# Altium schematic sheet LMS7002M Data.SchDoc
size E
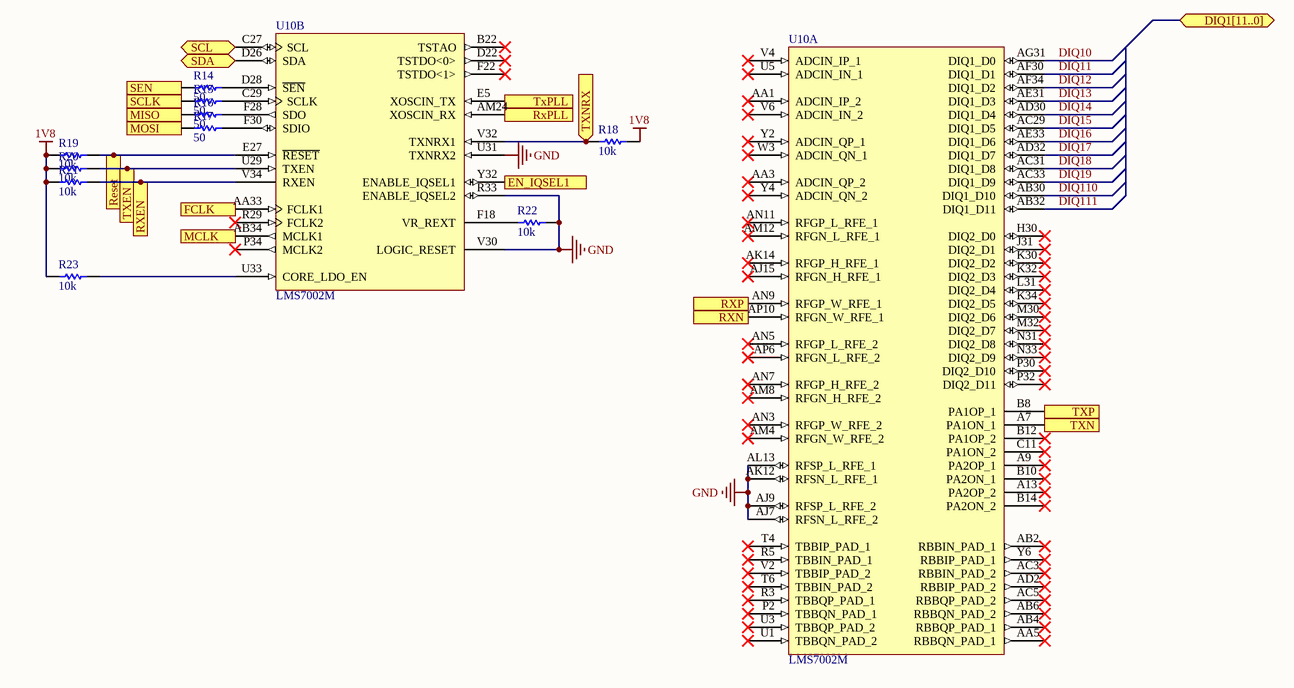
[diagram p0: LMS7002M Data.SchDoc]

## Parts
R14  value 50  [0402-A]  (hidden comment: Res1)
R15  value 50  [0402-A]  (hidden comment: Res1)
R16  value 50  [0402-A]  (hidden comment: Res1)
R17  value 50  [0402-A]  (hidden comment: Res1)
R18  value 10k  [0402-A]  (hidden comment: Res1)
R19  value 10k  [0402-A]  (hidden comment: Res1)
R20  value 10k  [0402-A]  (hidden comment: Res1)
R21  value 10k  [0402-A]  (hidden comment: Res1)
R22  value 10k  [0402-A]  (hidden comment: Res1)
R23  value 10k  [0402-A]  (hidden comment: Res1)
U10  LMS7002M  [LM-QFN-261_V]  (parts A,B of 4)

## Ports
DIQ1[11..0] (bidir), EN_IQSEL1 (in), FCLK (in), MCLK (out), MISO (out), MOSI (in), Reset (in), RXEN (in), RXN (in), RXP (in), RxPLL (in), SCL (bidir), SCLK (in), SDA (bidir), SEN (in), TXEN (in), TXN (out), TXNRX (in), TXP (out), TxPLL (in)

## Nets
1V8: R18.1 R19.2 R20.2 R21.2 R23.2
GND: R22.1 U10.AJ7(RFSN_L_RFE_2) U10.AJ9(RFSP_L_RFE_2) U10.AK12(RFSN_L_RFE_1) U10.AL13(RFSP_L_RFE_1) U10.R33(ENABLE_IQSEL2) U10.U31(TXNRX2) U10.V30(LOGIC_RESET)
DIQ10: U10.AG31(DIQ1_D0)
DIQ11: U10.AF30(DIQ1_D1)
DIQ12: U10.AF34(DIQ1_D2)
DIQ13: U10.AE31(DIQ1_D3)
DIQ14: U10.AD30(DIQ1_D4)
DIQ15: U10.AC29(DIQ1_D5)
DIQ16: U10.AE33(DIQ1_D6)
DIQ17: U10.AD32(DIQ1_D7)
DIQ18: U10.AC31(DIQ1_D8)
DIQ19: U10.AC33(DIQ1_D9)
DIQ110: U10.AB30(DIQ1_D10)
DIQ111: U10.AB32(DIQ1_D11)
EN_IQSEL1: U10.Y32(ENABLE_IQSEL1) ; port EN_IQSEL1
FCLK: U10.AA33(FCLK1) ; port FCLK
MCLK: U10.AB34(MCLK1) ; port MCLK
MISO: R16.2 ; port MISO
MOSI: R17.2 ; port MOSI
Reset: R19.1 U10.E27(~{RESET}) ; port Reset
RXEN: R21.1 U10.V34(RXEN) ; port RXEN
RXN: U10.AP10(RFGN_W_RFE_1) ; port RXN
RXP: U10.AN9(RFGP_W_RFE_1) ; port RXP
RxPLL: U10.AM24(XOSCIN_RX) ; port RxPLL
SCL: U10.C27(SCL) ; port SCL
SCLK: R15.2 ; port SCLK
SDA: U10.D26(SDA) ; port SDA
SEN: R14.2 ; port SEN
TXEN: R20.1 U10.U29(TXEN) ; port TXEN
TXN: U10.A7(PA1ON_1) ; port TXN
TXNRX: R18.2 U10.V32(TXNRX1) ; port TXNRX
TXP: U10.B8(PA1OP_1) ; port TXP
TxPLL: U10.E5(XOSCIN_TX) ; port TxPLL
NetR14_1: R14.1 U10.D28(~{SEN})
NetR15_1: R15.1 U10.C29(SCLK)
NetR16_1: R16.1 U10.F28(SDO)
NetR17_1: R17.1 U10.F30(SDIO)
NetR22_2: R22.2 U10.F18(VR_REXT)
NetR23_1: R23.1 U10.U33(CORE_LDO_EN)

Not connected (* = marked no-connect by the designer): U10 A9(PA2OP_1)* A13(PA2OP_2)* AA1(ADCIN_IP_2)* AA3(ADCIN_QP_2)* AA5(RBBQN_PAD_1)* AB2(RBBIN_PAD_1)* AB4(RBBQP_PAD_1)* AB6(RBBQN_PAD_2)* AC3(RBBIN_PAD_2)* AC5(RBBQP_PAD_2)* AD2(RBBIP_PAD_2)* AJ15(RFGN_H_RFE_1)* AK14(RFGP_H_RFE_1)* AM4(RFGN_W_RFE_2)* AM8(RFGN_H_RFE_2)* AM12(RFGN_L_RFE_1)* AN3(RFGP_W_RFE_2)* AN5(RFGP_L_RFE_2)* AN7(RFGP_H_RFE_2)* AN11(RFGP_L_RFE_1)* AP6(RFGN_L_RFE_2)* B10(PA2ON_1)* B12(PA1OP_2)* B14(PA2ON_2)* B22(TSTAO)* C11(PA1ON_2)* D22(TSTDO<0>)* F22(TSTDO<1>)* H30(DIQ2_D0)* J31(DIQ2_D1)* K30(DIQ2_D2)* K32(DIQ2_D3)* K34(DIQ2_D5)* L31(DIQ2_D4)* M30(DIQ2_D6)* M32(DIQ2_D7)* N31(DIQ2_D8)* N33(DIQ2_D9)* P2(TBBQN_PAD_1)* P30(DIQ2_D10)* P32(DIQ2_D11)* P34(MCLK2)* R3(TBBQP_PAD_1)* R5(TBBIN_PAD_1)* R29(FCLK2)* T4(TBBIP_PAD_1)* T6(TBBIN_PAD_2)* U1(TBBQN_PAD_2)* U3(TBBQP_PAD_2)* U5(ADCIN_IN_1)* V2(TBBIP_PAD_2)* V4(ADCIN_IP_1)* V6(ADCIN_IN_2)* W3(ADCIN_QN_1)* Y2(ADCIN_QP_1)* Y4(ADCIN_QN_2)* Y6(RBBIP_PAD_1)*

## Library data of the parts
R14-R23 = Res1: Resistor; Published: 8-Jun-2000; LatestRevisionDate: 17-Jul-2002; LatestRevisionNote: Re-released for DXP Platform.; PackageReference: AXIAL-0.3; Publisher: Altium Limited; PackageDescription: Axial Device, Thru-Hole; 2 Leads; 0.3 in Pin Spacing
U10 = CMP-2000-06561-1: FPRF MIMO Transceiver IC with Integrated Microcontroller, 1.1 to 1.89 V, -40 to 85 degC, 261-Pin QFN, RoHS; Manufacturer: LimeMicrosystemsLtd; Current - Receiving: 420mA; Protocol: CDMA,GSM,HSPA,LTE,TD-SCDMA,WCDMA; Frequency: 100kHz~3.8GHz; Current - Transmitting: 350mA; Memory Size: 10kBSRAM; Power - Output: 0dBm; Serial Interfaces: SPI; RF Family/Standard: Cellular; Voltage - Supply: 1.1V~1.89V; GPIO: -; Data Rate (Max): -; Family: RFTransceiverICs; Modulation: -; Mounting Technology: SurfaceMount; Datasheet URL: http://www.richardsonrfpd.com/resources/RellDocuments/SYS_31/LMS7002M.pdf; Package Description: 261-Pin Quad Flat No-lead Package, Body 11.5 x 11.5 mm, Pitch 0.666 mm; Series: -; Sensitivity: -; Category: RF/IFandRFID; Package Reference: QFN-261; Package / Case: 261-SMDModule; Package URL: http://cdn.limemicro.com/wp-content/uploads/2015/08/LMS7002M-PCB-Layout-Recommendations-1.0r5.pdf; Operating Temperature: -40°C~85°C; Manufacturer URL: http://www.limemicro.com/; Packaging: Tray; Datasheet Version: Rev. 2.8.0, 09/2015; Type: TxRx+MCU